# EAGLE board axiom_beta_power_board_v0.27 (EAGLE 7.0.0), part 1 of 3
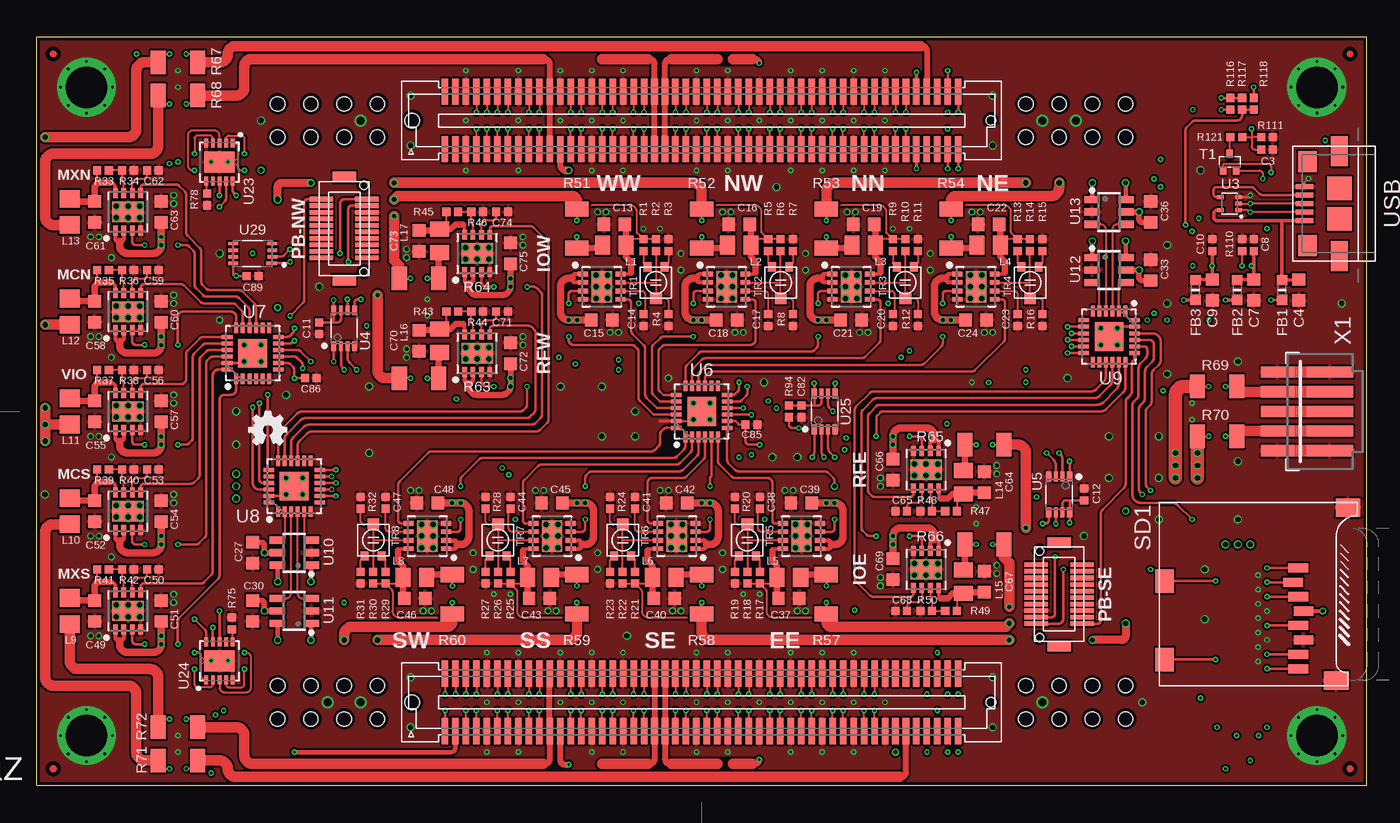
[diagram p10: board, top side]
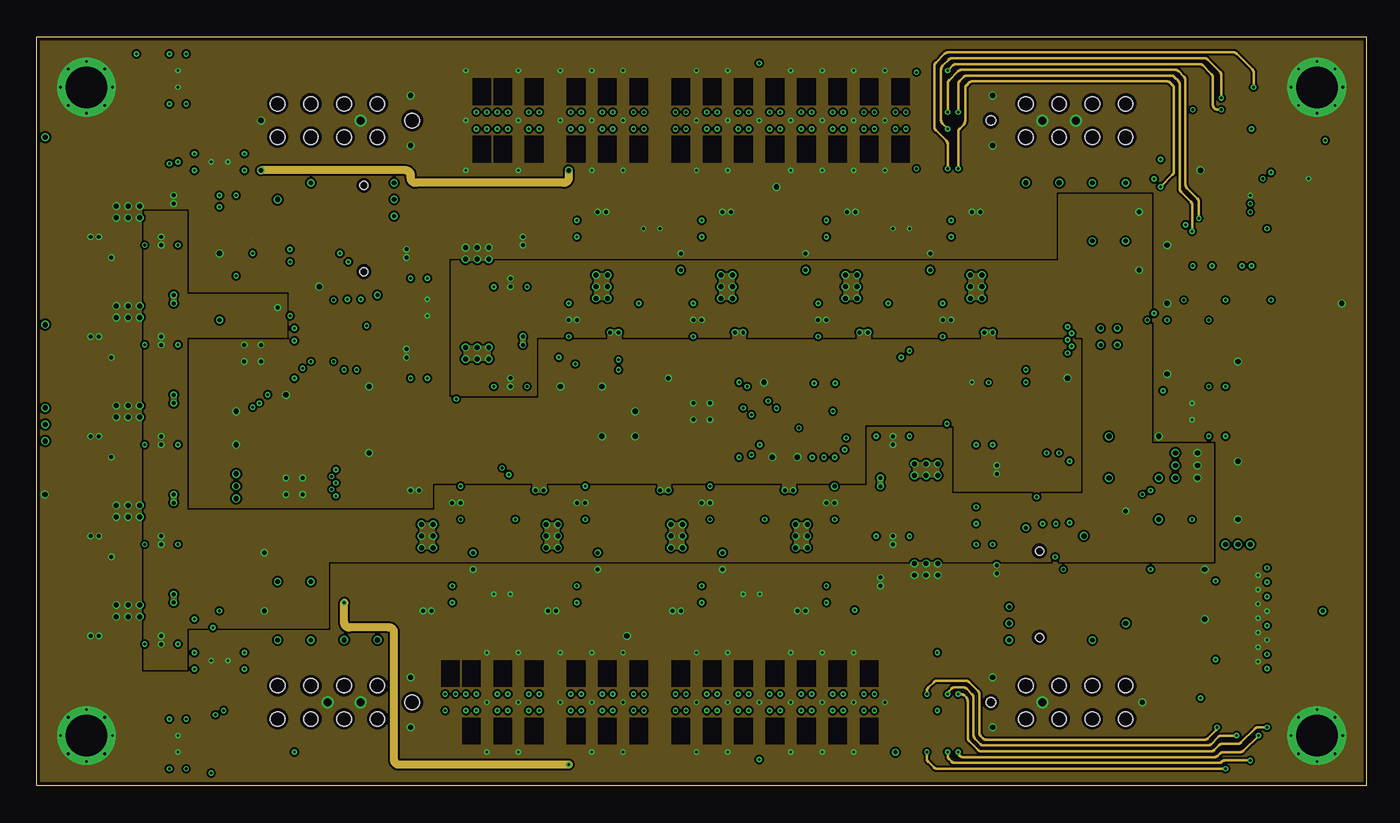
[diagram p11: board, inner layer Route2]
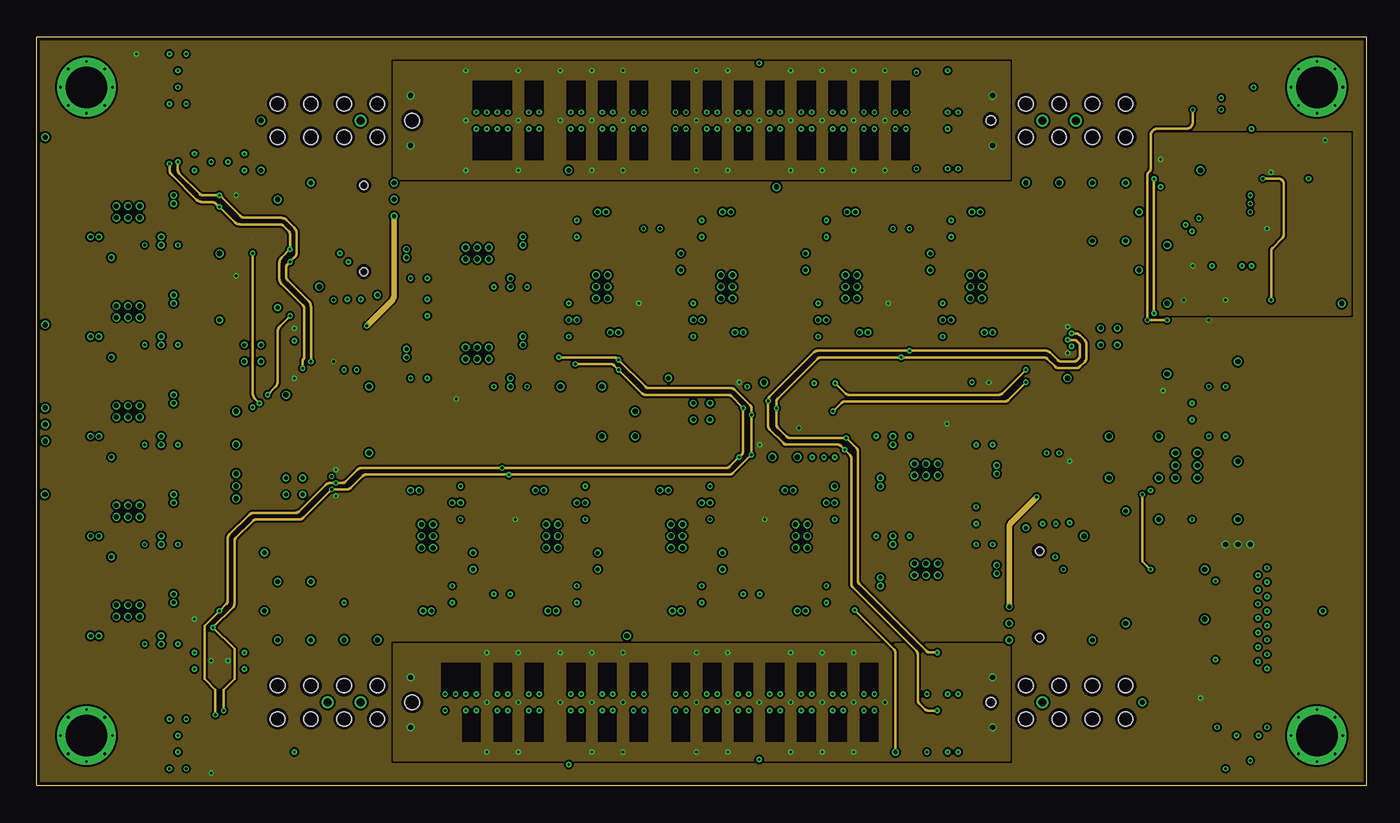
[diagram p12: board, inner layer Route15]
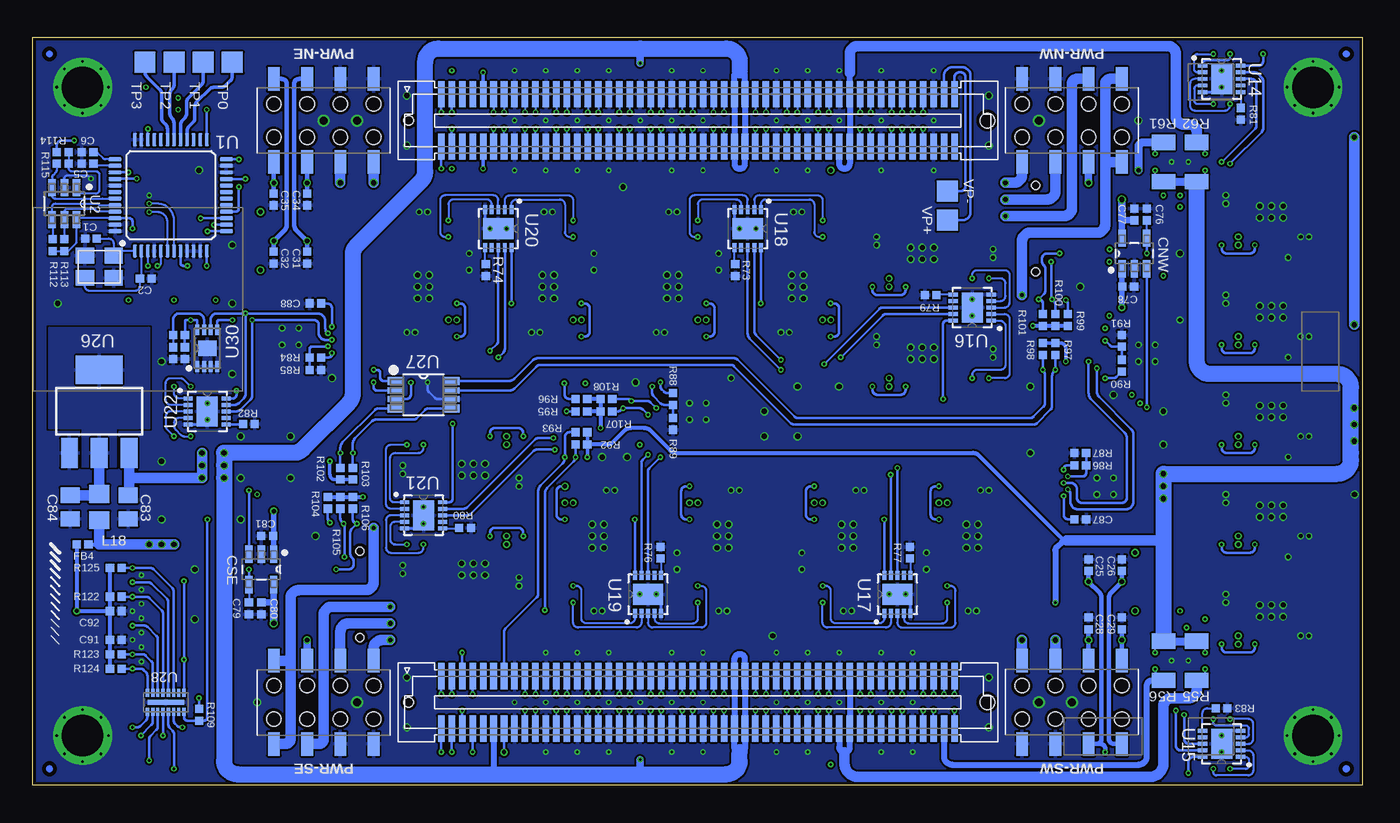
[diagram p13: board, bottom side, seen from below]

Size 101.6 x 57.15 mm. Coordinates in mm from the lower left corner, seen from the top.
Outline: 101.6,57.15 0,57.15 0,0 101.6,0 101.6,57.15
Copper layers (1*2*15*16): Top 0.035559375mm / dielectric 0.17018125mm / Route2 0.01778125mm / dielectric 47mil / Route15 0.01778125mm / dielectric 0.17018125mm / Bottom 0.035559375mm
Design rules "OSHPark-4layer-tuned *": minimum track width 5mil, minimum drill 8mil, track to track 6mil, track to pad 5mil, pad to pad 5mil, via to via 5mil, smd to smd 0mil, copper to edge 10mil, drill to drill 6mil, minimum pad ring 4mil, minimum via ring 4mil, stop-mask expansion 2mil, vias tented up to drill 25mil, thermal gap 6mil
Net classes: 1 LVDS: width 0.152 mm, drill 0.203 mm, clearance 0.152 mm
tKeepout: area 1.3,50.8 to 6.3,55.9; area 1.3,1.3 to 6.3,6.3; area 95.2,1.3 to 100.3,6.3; area 95.2,50.8 to 100.3,55.9
bKeepout: area 95.2,50.8 to 100.3,55.9; area 95.2,1.3 to 100.3,6.3; area 1.3,1.3 to 6.3,6.3; area 1.3,50.8 to 6.3,55.9
tRestrict: area 99.8,55.3 to 100.9,56.4; area 99.8,0.7 to 100.9,1.8; area 0.7,55.3 to 1.8,56.4; area 0.7,0.7 to 1.8,1.8
bRestrict: area 99.8,55.3 to 100.9,56.4; area 99.8,0.7 to 100.9,1.8; area 0.7,55.3 to 1.8,56.4; area 0.7,0.7 to 1.8,1.8

## Footprints (pad centres in the part's own frame; a part is rotated, then mirrored left to right if it is on the bottom)
µZ-SOCKET-NOHOLES-R = smd 0.5 x 2: 1 19.6,24.425; 2 19.6,20.027; 3 18.8,24.425; 4 18.8,20.027; 5 18,24.425; 6 18,20.027; 7 17.2,24.425; 8 17.2,20.027; 9 16.4,24.425; 10 16.4,20.027; 11 15.6,24.425; 12 15.6,20.027; 13 14.8,24.425; 14 14.8,20.027; 15 14,24.425; 16 14,20.027; 17 13.2,24.425; 18 13.2,20.027; 19 12.4,24.425; 20 12.4,20.027; 21 11.6,24.425; 22 11.6,20.027; 23 10.8,24.425; 24 10.8,20.027; 25 10,24.425; 26 10,20.027; 27 9.2,24.425; 28 9.2,20.027; 29 8.4,24.425; 30 8.4,20.027; 31 7.6,24.425; 32 7.6,20.027; 33 6.8,24.425; 34 6.8,20.027; 35 6,24.425; 36 6,20.027; 37 5.2,24.425; 38 5.2,20.027; 39 4.4,24.425; 40 4.4,20.027; 41 3.6,24.425; 42 3.6,20.027; 43 2.8,24.425; 44 2.8,20.027; 45 2,24.425; 46 2,20.027; 47 1.2,24.425; 48 1.2,20.027; 49 0.4,24.425; 50 0.4,20.027; 51 -0.4,24.425; 52 -0.4,20.027; 53 -1.2,24.425; 54 -1.2,20.027; 55 -2,24.425; 56 -2,20.027; 57 -2.8,24.425; 58 -2.8,20.027; 59 -3.6,24.425; 60 -3.6,20.027; 61 -4.4,24.425; 62 -4.4,20.027; 63 -5.2,24.425; 64 -5.2,20.027; 65 -6,24.425; 66 -6,20.027; 67 -6.8,24.425; 68 -6.8,20.027; 69 -7.6,24.425; 70 -7.6,20.027; 71 -8.4,24.425; 72 -8.4,20.027; 73 -9.2,24.425; 74 -9.2,20.027; 75 -10,24.425; 76 -10,20.027; 77 -10.8,24.425; 78 -10.8,20.027; 79 -11.6,24.425; 80 -11.6,20.027; 81 -12.4,24.425; 82 -12.4,20.027; 83 -13.2,24.425; 84 -13.2,20.027; 85 -14,24.425; 86 -14,20.027; 87 -14.8,24.425; 88 -14.8,20.027; 89 -15.6,24.425; 90 -15.6,20.027; 91 -16.4,24.425; 92 -16.4,20.027; 93 -17.2,24.425; 94 -17.2,20.027; 95 -18,24.425; 96 -18,20.027; 97 -18.8,24.425; 98 -18.8,20.027; 99 -19.6,24.425; 100 -19.6,20.027; 101 19.6,-20.025; 102 19.6,-24.425; 103 18.8,-20.027; 104 18.8,-24.425; 105 18,-20.027; 106 18,-24.425; 107 17.2,-20.027; 108 17.2,-24.425; 109 16.4,-20.027; 110 16.4,-24.425; 111 15.6,-20.027; 112 15.6,-24.425; 113 14.8,-20.027; 114 14.8,-24.425; 115 14,-20.027; 116 14,-24.425; 117 13.2,-20.027; 118 13.2,-24.425; 119 12.4,-20.027; 120 12.4,-24.425; 121 11.6,-20.027; 122 11.6,-24.425; 123 10.8,-20.027; 124 10.8,-24.425; 125 10,-20.027; 126 10,-24.425; 127 9.2,-20.027; 128 9.2,-24.425; 129 8.4,-20.027; 130 8.4,-24.425; 131 7.6,-20.027; 132 7.6,-24.425; 133 6.8,-20.027; 134 6.8,-24.425; 135 6,-20.027; 136 6,-24.425; 137 5.2,-20.027; 138 5.2,-24.425; 139 4.4,-20.027; 140 4.4,-24.425; 141 3.6,-20.027; 142 3.6,-24.425; 143 2.8,-20.027; 144 2.8,-24.425; 145 2,-20.027; 146 2,-24.425; 147 1.2,-20.027; 148 1.2,-24.425; 149 0.4,-20.027; 150 0.4,-24.425; 151 -0.4,-20.027; 152 -0.4,-24.425; 153 -1.2,-20.027; 154 -1.2,-24.425; 155 -2,-20.027; 156 -2,-24.425; 157 -2.8,-20.027; 158 -2.8,-24.425; 159 -3.6,-20.027; 160 -3.6,-24.425; 161 -4.4,-20.027; 162 -4.4,-24.425; 163 -5.2,-20.027; 164 -5.2,-24.425; 165 -6,-20.027; 166 -6,-24.425; 167 -6.8,-20.027; 168 -6.8,-24.425; 169 -7.6,-20.027; 170 -7.6,-24.425; 171 -8.4,-20.027; 172 -8.4,-24.425; 173 -9.2,-20.027; 174 -9.2,-24.425; 175 -10,-20.027; 176 -10,-24.425; 177 -10.8,-20.027; 178 -10.8,-24.425; 179 -11.6,-20.027; 180 -11.6,-24.425; 181 -12.4,-20.027; 182 -12.4,-24.425; 183 -13.2,-20.027; 184 -13.2,-24.425; 185 -14,-20.027; 186 -14,-24.425; 187 -14.8,-20.027; 188 -14.8,-24.425; 189 -15.6,-20.027; 190 -15.6,-24.425; 191 -16.4,-20.027; 192 -16.4,-24.425; 193 -17.2,-20.027; 194 -17.2,-24.425; 195 -18,-20.027; 196 -18,-24.425; 197 -18.8,-20.027; 198 -18.8,-24.425; 199 -19.6,-20.027; 200 -19.6,-24.425 | hole 0.725: 22.1,22.225; 22.1,-22.225 | hole 1.125: -22.1,22.225; -22.1,-22.225
0402-B = smd 0.62 x 0.62: 1 -0.45,0; 2 0.45,0
0603-B = smd 0.95 x 1: 1 -0.8,0; 2 0.8,0
0805-B = smd 1.15 x 1.45: 1 -0.9,0; 2 0.9,0
SOT95P280X145-5N = smd 1.321 x 0.559: 1 -1.168,0.94; 2 -1.168,0; 3 -1.168,-0.94; 4 1.168,-0.94; 5 1.168,0.94
DFN65P300X300X100-9N = smd 0.762 x 0.356: 1 -1.422,0.965; 2 -1.422,0.33; 3 -1.422,-0.33; 4 -1.422,-0.965; 5 1.422,-0.965; 6 1.422,-0.33; 7 1.422,0.33; 8 1.422,0.965 | smd 1.549 x 2.413: 9 0,0
_0603MP = smd 0.8 x 0.8: 1 -0.762,0; 2 0.762,0
0805-A = smd 1.35 x 1.55: 1 -1,0; 2 1,0
DF12(XX)-20DP-0.5V = smd 1.8 x 0.35: 1 -1.75,2.25; 2 1.75,2.25; 3 -1.75,1.75; 4 1.75,1.75; 5 -1.75,1.25; 6 1.75,1.25; 7 -1.75,0.75; 8 1.75,0.75; 9 -1.75,0.25; 10 1.75,0.25; 11 -1.75,-0.25; 12 1.75,-0.25; 13 -1.75,-0.75; 14 1.75,-0.75; 15 -1.75,-1.25; 16 1.75,-1.25; 17 -1.75,-1.75; 18 1.75,-1.75; 19 -1.75,-2.25; 20 1.75,-2.25 | smd 1.8 x 0.8: M1 0,3.95; M2 0,-3.95 | hole 0.625: 1.5,-3.3; 1.5,3.3
R2X04 = smd 0.9 x 1.8: 1 -3.81,3.175; 2 -3.81,-3.175; 3 -1.27,3.175; 4 -1.27,-3.175; 5 1.27,3.175; 6 1.27,-3.175; 7 3.81,3.175; 8 3.81,-3.175 | hole 1.1: -3.81,1.27; -1.27,1.27; -1.27,-1.27; -3.81,-1.27; 1.27,1.27; 1.27,-1.27; 3.81,1.27; 3.81,-1.27
ABM8G = smd 1.4 x 1.2: 1 -1.1,-0.85; 2 1.1,-0.85; 3 1.1,0.85; 4 -1.1,0.85
1206-B = smd 1.15 x 1.8: 1 -1.5,0; 2 1.5,0
TF-MICRO-SD_PP2 = smd 0.7 x 1.5: 1 9,-10.64; 2 7.9,-10.24; 3 6.8,-10.64; 4 5.7,-11.04; 5 4.6,-10.64; 6 3.5,-11.04; 7 2.4,-10.64; 8 1.3,-10.64 | smd 1.8 x 1.4: CD1 2,-0.44; CD2 8,-0.44 | smd 1.4 x 1.9: MT1 0.4,-13.54; MT2 13.6,-14.44
SOT416 = smd 0.5 x 0.6: 1 -0.5,-0.65; 2 0.5,-0.65; 3 0,0.65
TP16SQ = smd 1.6 x 1.6: TP 0,0
TRIM-PVZ2A = smd 0.6 x 0.7: 1 -0.65,-1.2; 3 0.65,-1.2 | smd 0.9 x 0.9: 2 0,1.2
LQFP48 = smd 0.3 x 1: 1 -2.75,-4.25; 2 -2.25,-4.25; 3 -1.75,-4.25; 4 -1.25,-4.25; 5 -0.75,-4.25; 6 -0.25,-4.25; 7 0.25,-4.25; 8 0.75,-4.25; 9 1.25,-4.25; 10 1.75,-4.25; 11 2.25,-4.25; 12 2.75,-4.25; 25 2.75,4.25; 26 2.25,4.25; 27 1.75,4.25; 28 1.25,4.25; 29 0.75,4.25; 30 0.25,4.25; 31 -0.25,4.25; 32 -0.75,4.25; 33 -1.25,4.25; 34 -1.75,4.25; 35 -2.25,4.25; 36 -2.75,4.25 | smd 1 x 0.3: 13 4.25,-2.75; 14 4.25,-2.25; 15 4.25,-1.75; 16 4.25,-1.25; 17 4.25,-0.75; 18 4.25,-0.25; 19 4.25,0.25; 20 4.25,0.75; 21 4.25,1.25; 22 4.25,1.75; 23 4.25,2.25; 24 4.25,2.75; 37 -4.25,2.75; 38 -4.25,2.25; 39 -4.25,1.75; 40 -4.25,1.25; 41 -4.25,0.75; 42 -4.25,0.25; 43 -4.25,-0.25; 44 -4.25,-0.75; 45 -4.25,-1.25; 46 -4.25,-1.75; 47 -4.25,-2.25; 48 -4.25,-2.75
SOT95P280X145-6N = smd 1.27 x 0.559: 1 -1.219,0.94; 2 -1.219,0; 3 -1.219,-0.94; 4 1.219,-0.94; 5 1.219,0; 6 1.219,0.94
R-PDSO-N5 = smd 0.3 x 0.5: 1 -0.5,-0.675; 2 0,-0.675; 3 0.5,-0.675; 4 0.5,0.675; 5 -0.5,0.675
VSSOP-8 = smd 0.75 x 0.4: 1 -1.375,0.8; 4 -1.375,-0.8; 5 1.375,-0.8; 8 1.375,0.8 | smd 0.75 x 0.3: 2 -1.375,0.25; 3 -1.375,-0.25; 6 1.375,-0.25; 7 1.375,0.25
QFN50P400X400X80-25N = smd 0.813 x 0.305: 1 -1.95,1.25; 2 -1.95,0.75; 3 -1.95,0.25; 4 -1.95,-0.25; 5 -1.95,-0.75; 6 -1.95,-1.25; 13 1.95,-1.25; 14 1.95,-0.75; 15 1.95,-0.25; 16 1.95,0.25; 17 1.95,0.75; 18 1.95,1.25 | smd 0.305 x 0.813: 7 -1.25,-1.95; 8 -0.75,-1.95; 9 -0.25,-1.95; 10 0.25,-1.95; 11 0.75,-1.95; 12 1.25,-1.95; 19 1.25,1.95; 20 0.75,1.95; 21 0.25,1.95; 22 -0.25,1.95; 23 -0.75,1.95; 24 -1.25,1.95 | smd 2.2 x 2.2: 25 0,0
SOT23-6 = smd 0.55 x 1.2: 1 -0.95,-1.3; 2 0,-1.3; 3 0.95,-1.3; 4 0.95,1.3; 5 0,1.3; 6 -0.95,1.3
DFN3X3_10LEAD = smd 0.7 x 0.3: 1 -1.45,1; 2 -1.45,0.5; 3 -1.45,0; 4 -1.45,-0.5; 5 -1.45,-1; 6 1.45,-1; 7 1.45,-0.5; 8 1.45,0; 9 1.45,0.5; 10 1.45,1 | smd 1.6 x 2.3: EPAD 0,0
SOT-223 = smd 1.27 x 2.286: 1 -2.286,-3.175; 2 0,-3.175; 3 2.286,-3.175 | smd 3.556 x 2.159: TER 0,3.175
SOP65P490X300-8N = smd 1.15 x 0.6: 1 -2.175,1.05; 4 -2.175,-1.05; 5 2.175,-1.05; 8 2.175,1.05 | smd 1.15 x 0.45: 2 -2.175,0.325; 3 -2.175,-0.325; 6 2.175,-0.325; 7 2.175,0.325
SON40P135X330X55-17N = smd 0.61 x 0.254: 1 -0.737,1.397; 2 -0.737,0.991; 3 -0.737,0.61; 4 -0.737,0.203; 5 -0.737,-0.203; 6 -0.737,-0.61; 7 -0.737,-0.991; 8 -0.737,-1.397; 9 0.737,-1.397; 10 0.737,-0.991; 11 0.737,-0.61; 12 0.737,-0.203; 13 0.737,0.203; 14 0.737,0.61; 15 0.737,0.991; 16 0.737,1.397 | smd 0.406 x 2.794: 17 0,0
SOT996-2/3 = smd 0.25 x 0.85: 1 -0.75,-1.45 | smd 0.25 x 0.75: 2 -0.25,-1.5; 3 0.25,-1.5; 4 0.75,-1.5; 5 0.75,1.5; 6 0.25,1.5; 7 -0.25,1.5; 8 -0.75,1.5
DFN200X300X100-9N = smd 0.813 x 0.305: 1 -1.397,0.762; 2 -1.397,0.254; 3 -1.397,-0.254; 4 -1.397,-0.762; 5 1.397,-0.762; 6 1.397,-0.254; 7 1.397,0.254; 8 1.397,0.762 | smd 1.194 x 1.397: EP 0,0
MICRO-AB-H-SMT = smd 0.4 x 1.35: 1 -1.3,4.125; 2 -0.65,4.125; 3 0,4.125; 4 0.65,4.125; 5 1.3,4.125 | smd 2.3 x 1.3: Z1 -4,1.45; Z4 4,1.45 | smd 1.8 x 1.9: Z2 -1.15,1.45; Z3 1.15,1.45 | smd 1.6 x 1.4: Z5 -3.2,3.9; Z6 3.2,3.9
PICO-SPOX-5 = smd 0.85 x 2.55: 1 -3,-6.5; 2 -1.5,-6.5; 3 0,-6.5; 4 1.5,-6.5; 5 3,-6.5 | smd 0.85 x 3.55: 1A -3,-2.5; 2A -1.5,-2.5; 3A 0,-2.5; 4A 1.5,-2.5; 5A 3,-2.5
µZ-CONONLY = smd 0.5 x 2: 1 19.6,-24.226; 2 19.6,-20.226; 3 18.8,-24.226; 4 18.8,-20.226; 5 18,-24.226; 6 18,-20.226; 7 17.2,-24.226; 8 17.2,-20.226; 9 16.4,-24.226; 10 16.4,-20.226; 11 15.6,-24.226; 12 15.6,-20.226; 13 14.8,-24.226; 14 14.8,-20.226; 15 14,-24.226; 16 14,-20.226; 17 13.2,-24.226; 18 13.2,-20.226; 19 12.4,-24.226; 20 12.4,-20.226; 21 11.6,-24.226; 22 11.6,-20.226; 23 10.8,-24.226; 24 10.8,-20.226; 25 10,-24.226; 26 10,-20.226; 27 9.2,-24.226; 28 9.2,-20.226; 29 8.4,-24.226; 30 8.4,-20.226; 31 7.6,-24.226; 32 7.6,-20.226; 33 6.8,-24.226; 34 6.8,-20.226; 35 6,-24.226; 36 6,-20.226; 37 5.2,-24.226; 38 5.2,-20.226; 39 4.4,-24.226; 40 4.4,-20.226; 41 3.6,-24.226; 42 3.6,-20.226; 43 2.8,-24.226; 44 2.8,-20.226; 45 2,-24.226; 46 2,-20.226; 47 1.2,-24.226; 48 1.2,-20.226; 49 0.4,-24.226; 50 0.4,-20.226; 51 -0.4,-24.226; 52 -0.4,-20.226; 53 -1.2,-24.226; 54 -1.2,-20.226; 55 -2,-24.226; 56 -2,-20.226; 57 -2.8,-24.226; 58 -2.8,-20.226; 59 -3.6,-24.226; 60 -3.6,-20.226; 61 -4.4,-24.226; 62 -4.4,-20.226; 63 -5.2,-24.226; 64 -5.2,-20.226; 65 -6,-24.226; 66 -6,-20.226; 67 -6.8,-24.226; 68 -6.8,-20.226; 69 -7.6,-24.226; 70 -7.6,-20.226; 71 -8.4,-24.226; 72 -8.4,-20.226; 73 -9.2,-24.226; 74 -9.2,-20.226; 75 -10,-24.226; 76 -10,-20.226; 77 -10.8,-24.226; 78 -10.8,-20.226; 79 -11.6,-24.226; 80 -11.6,-20.226; 81 -12.4,-24.226; 82 -12.4,-20.226; 83 -13.2,-24.226; 84 -13.2,-20.226; 85 -14,-24.226; 86 -14,-20.226; 87 -14.8,-24.226; 88 -14.8,-20.226; 89 -15.6,-24.226; 90 -15.6,-20.226; 91 -16.4,-24.226; 92 -16.4,-20.226; 93 -17.2,-24.226; 94 -17.2,-20.226; 95 -18,-24.226; 96 -18,-20.226; 97 -18.8,-24.226; 98 -18.8,-20.226; 99 -19.6,-24.226; 100 -19.6,-20.226; 101 19.6,20.226; 102 19.6,24.226; 103 18.8,20.226; 104 18.8,24.226; 105 18,20.226; 106 18,24.226; 107 17.2,20.226; 108 17.2,24.226; 109 16.4,20.226; 110 16.4,24.226; 111 15.6,20.226; 112 15.6,24.226; 113 14.8,20.226; 114 14.8,24.226; 115 14,20.226; 116 14,24.226; 117 13.2,20.226; 118 13.2,24.226; 119 12.4,20.226; 120 12.4,24.226; 121 11.6,20.226; 122 11.6,24.226; 123 10.8,20.226; 124 10.8,24.226; 125 10,20.226; 126 10,24.226; 127 9.2,20.226; 128 9.2,24.226; 129 8.4,20.226; 130 8.4,24.226; 131 7.6,20.226; 132 7.6,24.226; 133 6.8,20.226; 134 6.8,24.226; 135 6,20.226; 136 6,24.226; 137 5.2,20.226; 138 5.2,24.226; 139 4.4,20.226; 140 4.4,24.226; 141 3.6,20.226; 142 3.6,24.226; 143 2.8,20.226; 144 2.8,24.226; 145 2,20.226; 146 2,24.226; 147 1.2,20.226; 148 1.2,24.226; 149 0.4,20.226; 150 0.4,24.226; 151 -0.4,20.226; 152 -0.4,24.226; 153 -1.2,20.226; 154 -1.2,24.226; 155 -2,20.226; 156 -2,24.226; 157 -2.8,20.226; 158 -2.8,24.226; 159 -3.6,20.226; 160 -3.6,24.226; 161 -4.4,20.226; 162 -4.4,24.226; 163 -5.2,20.226; 164 -5.2,24.226; 165 -6,20.226; 166 -6,24.226; 167 -6.8,20.226; 168 -6.8,24.226; 169 -7.6,20.226; 170 -7.6,24.226; 171 -8.4,20.226; 172 -8.4,24.226; 173 -9.2,20.226; 174 -9.2,24.226; 175 -10,20.226; 176 -10,24.226; 177 -10.8,20.226; 178 -10.8,24.226; 179 -11.6,20.226; 180 -11.6,24.226; 181 -12.4,20.226; 182 -12.4,24.226; 183 -13.2,20.226; 184 -13.2,24.226; 185 -14,20.226; 186 -14,24.226; 187 -14.8,20.226; 188 -14.8,24.226; 189 -15.6,20.226; 190 -15.6,24.226; 191 -16.4,20.226; 192 -16.4,24.226; 193 -17.2,20.226; 194 -17.2,24.226; 195 -18,20.226; 196 -18,24.226; 197 -18.8,20.226; 198 -18.8,24.226; 199 -19.6,20.226; 200 -19.6,24.226 | hole 1.125: -22.1,-22.225; -22.1,22.225 | hole 0.725: 22.1,-22.225; 22.1,22.225

## Placement (x,y rotation side)
BETA  µZ-FCI-SOCKET-NOHOLES-R  [µZ-SOCKET-NOHOLES-R]  50.8,28.57 0 top
C1  15p  [0402-B]  97.16,41.78 180 bottom
C2  15p  [0402-B]  92.96,38.73 0 bottom
C3  10n  [0402-B]  93.98,48.58 0 top
C4  100n  [0603-B]  96.39,37.85 270 top
C5  100n  [0402-B]  97.41,47.5 180 bottom
C6  100n  [0402-B]  97.41,48.39 180 bottom
C7  4u7  [0603-B]  92.96,37.85 270 top
C8  100n  [0402-B]  92.96,41.27 90 top
C9  4u7  [0603-B]  89.79,37.85 270 top
C10  100n  [0402-B]  89.79,41.27 90 top
C11  10n  [0402-B]  21.59,34.92 270 top
C12  10n  [0402-B]  80.01,22.23 90 top
C13  4u7  [0603-B]  44.13,42.86 180 top
C14  DNP  [0402-B]  46.35,35.56 270 top  (not fitted)
C15  10u  [0603-B]  43.18,35.56 0 top
C16  4u7  [0603-B]  53.66,42.86 180 top
C17  DNP  [0402-B]  55.88,35.56 270 top  (not fitted)
C18  10u  [0603-B]  52.7,35.56 0 top
C19  4u7  [0603-B]  63.18,42.86 180 top
C20  DNP  [0402-B]  65.41,35.56 270 top  (not fitted)
C21  10u  [0603-B]  62.23,35.56 0 top
C22  4u7  [0603-B]  72.71,42.86 180 top
C23  DNP  [0402-B]  74.93,35.56 270 top  (not fitted)
C24  10u  [0603-B]  71.75,35.56 0 top
C25  1u  [0402-B]  20.95,16.83 90 bottom
C26  1u  [0402-B]  18.41,16.83 90 bottom
C27  4u7  [0603-B]  16.51,17.78 270 top
C28  1u  [0402-B]  20.95,12.38 90 bottom
C29  1u  [0402-B]  18.41,12.38 90 bottom
C30  4u7  [0603-B]  16.51,13.33 270 top
C31  1u  [0402-B]  80.64,40.32 270 bottom
C32  1u  [0402-B]  83.19,40.32 270 bottom
C33  4u7  [0603-B]  85.09,39.37 90 top
C34  1u  [0402-B]  80.64,44.77 270 bottom
C35  1u  [0402-B]  83.19,44.77 270 bottom
C36  4u7  [0603-B]  85.09,43.81 90 top
C37  4u7  [0603-B]  57.47,14.29 0 top
C38  DNP  [0402-B]  55.24,21.59 90 top  (not fitted)
C39  10u  [0603-B]  58.42,21.59 180 top
C40  4u7  [0603-B]  47.94,14.29 0 top
C41  DNP  [0402-B]  45.72,21.59 90 top  (not fitted)
C42  10u  [0603-B]  48.89,21.59 180 top
C43  4u7  [0603-B]  38.42,14.29 0 top
C44  DNP  [0402-B]  36.19,21.59 90 top  (not fitted)
C45  10u  [0603-B]  39.37,21.59 180 top
C46  4u7  [0603-B]  28.89,14.29 0 top
C47  DNP  [0402-B]  26.67,21.59 90 top  (not fitted)
C48  10u  [0603-B]  29.84,21.59 180 top
C49  4u7  [0603-B]  4.45,13.33 270 top
C50  DNP  [0402-B]  8.89,16.51 0 top  (not fitted)
C51  10u  [0603-B]  9.52,13.33 90 top
C52  4u7  [0603-B]  4.45,20.95 270 top
C53  DNP  [0402-B]  8.89,24.13 0 top  (not fitted)
C54  10u  [0603-B]  9.52,20.95 90 top
C55  4u7  [0603-B]  4.45,28.57 270 top
C56  DNP  [0402-B]  8.89,31.75 0 top  (not fitted)
C57  10u  [0603-B]  9.52,28.57 90 top
C58  4u7  [0603-B]  4.45,36.2 270 top
C59  DNP  [0402-B]  8.89,39.37 0 top  (not fitted)
C60  10u  [0603-B]  9.52,36.2 90 top
C61  4u7  [0603-B]  4.45,43.81 270 top
C62  DNP  [0402-B]  8.89,46.99 0 top  (not fitted)
C63  10u  [0603-B]  9.52,43.81 90 top
C64  4u7  [0603-B]  72.39,23.18 90 top
C65  DNP  [0402-B]  66.04,20.95 180 top  (not fitted)
C66  10u  [0603-B]  65.41,24.13 270 top
C67  4u7  [0603-B]  72.39,15.56 90 top
C68  DNP  [0402-B]  66.04,13.33 180 top  (not fitted)
C69  10u  [0603-B]  65.41,16.51 270 top
C70  4u7  [0603-B]  29.21,33.97 270 top
C71  DNP  [0402-B]  35.56,36.2 0 top  (not fitted)
C72  10u  [0603-B]  36.19,33.02 90 top
C73  4u7  [0603-B]  29.21,41.59 270 top
C74  DNP  [0402-B]  35.56,43.81 0 top  (not fitted)
C75  10u  [0603-B]  36.19,40.64 90 top
C76  10n  [0402-B]  16.51,43.62 90 bottom
C77  1u  [0402-B]  17.46,43.62 90 bottom
C78  1u  [0402-B]  17.93,38.1 0 bottom
C79  10n  [0402-B]  85.09,13.53 270 bottom
C80  1u  [0402-B]  84.14,13.53 270 bottom
C81  1u  [0402-B]  83.69,19.05 180 bottom
C82  10n  [0402-B]  58.42,28.57 270 top
C83  22u  [0805-B]  94.3,21.27 270 bottom
C84  22u  [0805-B]  98.74,21.27 270 bottom
C85  100n  [0402-B]  54.61,27.56 0 top
C86  100n  [0402-B]  20.95,31.11 0 top
C87  100n  [0402-B]  21.59,20.32 0 bottom
C88  100n  [0402-B]  80.01,36.83 180 bottom
C89  100n  [0402-B]  16.51,38.93 0 top
C90  100n  [0402-B]  89.98,33.02 270 bottom
C91  1u  [0402-B]  95.25,11.12 0 bottom
C92  100n  [0402-B]  95.25,13.32 0 bottom
CNW  SPX3819M5-L  [SOT95P280X145-5N]  17.46,40.64 90 bottom
CSE  SPX3819M5-L  [SOT95P280X145-5N]  84.14,16.51 270 bottom
EE  MCP1727-ADJE/MF  [DFN65P300X300X100-9N]  58.42,19.05 180 top
FB1  600R  [_0603MP]  95.12,37.85 270 top
FB2  600R  [_0603MP]  91.69,37.85 90 top
FB3  600R  [_0603MP]  88.52,37.85 90 top
FB4  [0402-B]  97.79,18.41 180 bottom
IOE  MCP1727-ADJE/MF  [DFN65P300X300X100-9N]  67.94,16.51 270 top
IOW  MCP1727-ADJE/MF  [DFN65P300X300X100-9N]  33.66,40.64 90 top
L1  [0805-B]  44.13,41.27 180 top
L2  [0805-B]  53.66,41.27 180 top
L3  [0805-B]  63.18,41.27 180 top
L4  [0805-B]  72.71,41.27 180 top
L5  [0805-B]  57.47,15.88 0 top
L6  [0805-B]  47.94,15.88 0 top
L7  [0805-B]  38.42,15.88 0 top
L8  [0805-B]  28.89,15.88 0 top
L9  [0805-A]  2.54,13.33 270 top
L10  [0805-A]  2.54,20.95 270 top
L11  [0805-A]  2.54,28.57 270 top
L12  [0805-A]  2.54,36.2 270 top
L13  [0805-A]  2.54,43.81 270 top
L14  [0805-B]  70.8,23.18 90 top
L15  [0805-B]  70.8,15.56 90 top
L16  [0805-B]  30.8,33.97 270 top
L17  [0805-B]  30.8,41.59 270 top
L18  [0805-A]  96.52,21.27 270 bottom
LOGO1  OSHW_LOGO_FILLX0100-NT  [OSHW_FILLX100_NOTEXT]  16.26,26.04 0 top
MCN  MCP1727-ADJE/MF  [DFN65P300X300X100-9N]  6.98,36.2 90 top
MCS  MCP1727-ADJE/MF  [DFN65P300X300X100-9N]  6.98,20.95 90 top
MXN  MCP1727-ADJE/MF  [DFN65P300X300X100-9N]  6.98,43.81 90 top
MXS  MCP1727-ADJE/MF  [DFN65P300X300X100-9N]  6.98,13.33 90 top
NE  MCP1727-ADJE/MF  [DFN65P300X300X100-9N]  71.75,38.1 0 top
NN  MCP1727-ADJE/MF  [DFN65P300X300X100-9N]  62.23,38.1 0 top
NW  MCP1727-ADJE/MF  [DFN65P300X300X100-9N]  52.7,38.1 0 top
PB-NW  DF12(XX)-20DP-0.5V  [DF12(XX)-20DP-0.5V]  23.49,42.55 0 top
PB-SE  DF12(XX)-20DP-0.5V  [DF12(XX)-20DP-0.5V]  78.1,14.6 180 top
PWR-NE  PINRC-2X04  [R2X04]  79.38,50.8 180 bottom  (not fitted)
PWR-NW  PINRC-2X04  [R2X04]  22.22,50.8 0 bottom  (not fitted)
PWR-SE  PINRC-2X04  [R2X04]  79.38,6.35 180 bottom  (not fitted)
PWR-SW  PINRC-2X04  [R2X04]  22.22,6.35 0 bottom  (not fitted)
Q1  SMD-4P-2G-3.2X2.5  [ABM8G]  96.52,39.62 180 bottom
R1  RB  [0402-B]  46.35,41.27 90 top
R2  DNP  [0402-B]  47.31,41.27 270 top  (not fitted)
R3  DNP  [0402-B]  48.26,41.27 90 top  (not fitted)
R4  RA  [0402-B]  48.26,35.56 270 top
R5  RB  [0402-B]  55.88,41.27 90 top
R6  DNP  [0402-B]  56.83,41.27 270 top  (not fitted)
R7  DNP  [0402-B]  57.78,41.27 90 top  (not fitted)
R8  RA  [0402-B]  57.78,35.56 270 top
R9  RB  [0402-B]  65.41,41.27 90 top
R10  DNP  [0402-B]  66.36,41.27 270 top  (not fitted)
R11  DNP  [0402-B]  67.31,41.27 90 top  (not fitted)
R12  RA  [0402-B]  67.31,35.56 270 top
R13  RB  [0402-B]  74.93,41.27 90 top
R14  DNP  [0402-B]  75.88,41.27 270 top  (not fitted)
R15  DNP  [0402-B]  76.83,41.27 90 top  (not fitted)
R16  RA  [0402-B]  76.83,35.56 270 top
R17  RB  [0402-B]  55.24,15.88 270 top
R18  DNP  [0402-B]  54.29,15.88 90 top  (not fitted)
R19  DNP  [0402-B]  53.34,15.88 270 top  (not fitted)
R20  RA  [0402-B]  53.34,21.59 90 top
R21  RB  [0402-B]  45.72,15.88 270 top
R22  DNP  [0402-B]  44.77,15.88 90 top  (not fitted)
R23  DNP  [0402-B]  43.81,15.88 270 top  (not fitted)
R24  RA  [0402-B]  43.81,21.59 90 top
R25  RB  [0402-B]  36.19,15.88 270 top
R26  DNP  [0402-B]  35.24,15.88 90 top  (not fitted)
R27  DNP  [0402-B]  34.29,15.88 270 top  (not fitted)
R28  RA  [0402-B]  34.29,21.59 90 top
R29  RB  [0402-B]  26.67,15.88 270 top
R30  DNP  [0402-B]  25.72,15.88 90 top  (not fitted)
R31  DNP  [0402-B]  24.76,15.88 270 top  (not fitted)
R32  RA  [0402-B]  24.76,21.59 90 top
R33  RD  [0402-B]  5.08,46.99 0 top
R34  RC  [0402-B]  6.98,46.99 0 top
R35  RD  [0402-B]  5.08,39.37 0 top
R36  RC  [0402-B]  6.98,39.37 0 top
R37  102k  [0402-B]  5.08,31.75 0 top
R38  20k  [0402-B]  6.98,31.75 0 top
R39  RD  [0402-B]  5.08,24.13 0 top
R40  RC  [0402-B]  6.98,24.13 0 top
R41  RD  [0402-B]  5.08,16.51 0 top
R42  RC  [0402-B]  6.98,16.51 0 top
R43  RD  [0402-B]  31.75,36.2 0 top
R44  RC  [0402-B]  33.66,36.2 0 top
R45  RD  [0402-B]  31.75,43.81 0 top
R46  RC  [0402-B]  33.66,43.81 0 top
R47  RD  [0402-B]  69.85,20.95 180 top
R48  RC  [0402-B]  67.94,20.95 180 top
R49  RD  [0402-B]  69.85,13.33 180 top
R50  RC  [0402-B]  67.94,13.33 180 top
R51  [1206-B]  41.27,42.55 90 top
R52  [1206-B]  50.8,42.55 90 top
R53  [1206-B]  60.32,42.55 90 top
R54  [1206-B]  69.85,42.55 90 top
R55  [1206-B]  12.7,9.52 270 bottom
R56  [1206-B]  15.24,9.52 270 bottom
R57  [1206-B]  60.32,14.6 270 top
R58  [1206-B]  50.8,14.6 270 top
R59  [1206-B]  41.27,14.6 270 top
R60  [1206-B]  31.75,14.6 270 top
R61  [1206-B]  15.24,47.62 90 bottom
R62  [1206-B]  12.7,47.62 90 bottom
R63  [1206-B]  29.21,31.11 180 top
R64  [1206-B]  29.21,38.73 180 top
R65  [1206-B]  72.39,26.04 0 top
R66  [1206-B]  72.39,18.41 0 top
R67  [1206-B]  10.79,55.25 0 top
R68  [1206-B]  10.79,52.7 0 top
R69  [1206-B]  90.17,30.48 180 top
R70  [1206-B]  90.17,26.67 180 top
R71  [1206-B]  10.79,1.9 0 top
R72  [1206-B]  10.79,4.45 0 top
R73  750R  [0402-B]  47.94,39.37 270 bottom
R74  1k27  [0402-B]  66.99,39.37 270 bottom
R75  430R  [0402-B]  14.92,12.38 90 top
R76  0R  [0402-B]  53.66,17.78 90 bottom
R77  100R  [0402-B]  34.61,17.78 90 bottom
R78  560R  [0402-B]  13.02,44.77 270 top
R79  5k6  [0402-B]  33.02,37.47 180 bottom
R80  9k1  [0402-B]  68.58,19.68 0 bottom
R81  2k0  [0402-B]  9.33,51.31 270 bottom
R82  1k6  [0402-B]  85.09,27.62 0 bottom
R83  2k7  [0402-B]  10.79,5.91 0 bottom
R84  22k  [0402-B]  80.01,32.7 180 bottom
R85  10k  [0402-B]  80.01,31.75 0 bottom
R86  13k  [0402-B]  21.59,24.45 0 bottom
R87  10k  [0402-B]  21.59,25.4 180 bottom
R88  13k  [0402-B]  52.7,29.53 270 bottom
R89  3k  [0402-B]  52.7,27.62 270 bottom
R90  15k  [0402-B]  18.41,32.07 90 bottom
R91  1k  [0402-B]  18.41,33.97 90 bottom
R92  4k7  [0402-B]  59.69,26.04 180 bottom
R93  4k7  [0402-B]  59.69,26.99 180 bottom
R94  200k  [0402-B]  57.47,28.57 90 top
R95  4k7  [0402-B]  59.69,28.57 180 bottom
R96  4k7  [0402-B]  59.69,29.53 180 bottom
R97  4k7  [0402-B]  23.49,33.34 270 bottom
R98  4k7  [0402-B]  24.45,33.34 270 bottom
R99  200k  [0402-B]  22.54,35.56 90 bottom
R100  4k7  [0402-B]  23.49,35.56 90 bottom
R101  4k7  [0402-B]  24.45,35.56 90 bottom
R102  4k7  [0402-B]  78.1,23.81 90 bottom
R103  4k7  [0402-B]  77.15,23.81 90 bottom
R104  200k  [0402-B]  79.06,21.59 270 bottom
R105  4k7  [0402-B]  78.1,21.59 270 bottom
R106  4k7  [0402-B]  77.15,21.59 270 bottom
R107  4k7  [0402-B]  57.78,28.57 0 bottom
R108  4k7  [0402-B]  57.78,29.53 0 bottom
R109  10k  [0402-B]  88.9,5.4 270 bottom
R110  12k  [0402-B]  92.07,41.27 270 top
R111  6k8  [0402-B]  93.98,49.53 180 top
R112  10k  [0402-B]  100.08,41.27 270 bottom
R113  10k  [0402-B]  99.19,41.27 270 bottom
R114  10k  [0402-B]  99.31,48.39 180 bottom
R115  2k  [0402-B]  99.31,47.5 180 bottom
R116  0R  [0402-B]  91.19,52.07 90 top
R117  0R  [0402-B]  92.07,52.07 90 top
R118  0R  [0402-B]  92.96,52.07 90 top
R119  10k  [0402-B]  90.42,34.42 180 bottom
R120  0R  [0402-B]  90.87,33.02 270 bottom
R121  3k9  [0402-B]  91.63,49.53 180 top
R122  50k  [0402-B]  95.25,14.42 0 bottom
R123  50k  [0402-B]  95.25,10.02 0 bottom
R124  50k  [0402-B]  95.25,8.92 0 bottom
R125  50k  [0402-B]  95.25,16.62 0 bottom
RFE  MCP1727-ADJE/MF  [DFN65P300X300X100-9N]  67.94,24.13 270 top
RFW  MCP1727-ADJE/MF  [DFN65P300X300X100-9N]  33.66,33.02 90 top
SD1  MICRO-SD-2CD  [TF-MICRO-SD_PP2]  85.72,7.62 90 top
SE  MCP1727-ADJE/MF  [DFN65P300X300X100-9N]  48.89,19.05 180 top
SS  MCP1727-ADJE/MF  [DFN65P300X300X100-9N]  39.37,19.05 180 top
SW  MCP1727-ADJE/MF  [DFN65P300X300X100-9N]  29.84,19.05 180 top
T1  NX3008PBKT  [SOT416]  91.12,47.62 0 top
TP0  TPTP16SQ  [TP16SQ]  86.36,55.25 0 bottom
TP1  TPTP16SQ  [TP16SQ]  88.58,55.25 180 bottom
TP2  TPTP16SQ  [TP16SQ]  90.81,55.25 0 bottom
TP3  TPTP16SQ  [TP16SQ]  93.03,55.25 0 bottom
TR1  PVZ2A  [TRIM-PVZ2A]  47.31,38.42 180 top
TR2  PVZ2A  [TRIM-PVZ2A]  56.83,38.42 180 top
TR3  PVZ2A  [TRIM-PVZ2A]  66.36,38.42 180 top
TR4  PVZ2A  [TRIM-PVZ2A]  75.88,38.42 180 top
TR5  PVZ2A  [TRIM-PVZ2A]  54.29,18.73 0 top
TR6  PVZ2A  [TRIM-PVZ2A]  44.77,18.73 0 top
TR7  PVZ2A  [TRIM-PVZ2A]  35.24,18.73 0 top
TR8  PVZ2A  [TRIM-PVZ2A]  25.72,18.73 0 top
U1  FT232HL  [LQFP48]  91.06,45.09 0 bottom
U2  93LC46BT-I/OT  [SOT95P280X145-6N]  99.19,44.45 270 bottom
U3  TPD3E001DRL  [R-PDSO-N5]  91.12,44.45 90 top
U4  GTL2002DC  [VSSOP-8]  23.49,34.92 90 top
U5  GTL2002DC  [VSSOP-8]  78.1,22.23 270 top
U6  MCP23018-E/MJ  [QFN50P400X400X80-25N]  50.8,28.57 90 top
U7  MCP23018-E/MJ  [QFN50P400X400X80-25N]  16.51,33.02 90 top
U8  MCP23018-E/MJ  [QFN50P400X400X80-25N]  19.68,22.86 90 top
U9  MCP23018-E/MJ  [QFN50P400X400X80-25N]  81.91,34.29 270 top
U10  AP7312-3333W6-7  [SOT23-6]  19.68,17.78 90 top
U11  AP7312-3333W6-7  [SOT23-6]  19.68,13.33 90 top
U12  AP7312-3333W6-7  [SOT23-6]  81.91,39.37 270 top
U13  AP7312-3333W6-7  [SOT23-6]  81.91,43.81 270 top
U14  PAC1720  [DFN3X3_10LEAD]  10.79,53.97 0 bottom
U15  PAC1720  [DFN3X3_10LEAD]  10.79,3.18 180 bottom
U16  PAC1720  [DFN3X3_10LEAD]  29.84,36.51 180 bottom
U17  PAC1720  [DFN3X3_10LEAD]  35.56,14.6 90 bottom
U18  PAC1720  [DFN3X3_10LEAD]  46.99,42.55 270 bottom
U19  PAC1720  [DFN3X3_10LEAD]  54.61,14.6 90 bottom
U20  PAC1720  [DFN3X3_10LEAD]  66.04,42.55 270 bottom
U21  PAC1720  [DFN3X3_10LEAD]  71.75,20.64 0 bottom
U22  PAC1720  [DFN3X3_10LEAD]  88.27,28.57 0 bottom
U23  PAC1720  [DFN3X3_10LEAD]  13.97,47.62 270 top
U24  PAC1720  [DFN3X3_10LEAD]  13.97,9.52 90 top
U25  GTL2002DC  [VSSOP-8]  60.2,28.57 90 top
U26  LD1117S33TR  [SOT-223]  96.52,28.57 0 bottom
U27  PCA9540BDP  [SOP65P490X300-8N]  71.75,29.84 0 bottom
U28  IP4251CZ16-8-TTL  [SON40P135X330X55-17N]  91.44,6.35 270 bottom
U29  LM75BGD  [SOT996-2/3]  16.51,40.64 90 top
U30  BR24G04NUX  [DFN200X300X100-9N]  88.27,33.4 90 bottom
USB  5_USB_3S  [MICRO-AB-H-SMT]  100.97,44.45 90 top
VIO  MCP1727-ADJE/MF  [DFN65P300X300X100-9N]  6.98,28.57 90 top
VP+  TPTP16SQ  [TP16SQ]  31.75,43.18 180 bottom
VP-  TPTP16SQ  [TP16SQ]  31.75,45.4 180 bottom
WW  MCP1727-ADJE/MF  [DFN65P300X300X100-9N]  43.18,38.1 0 top
X1  PICO-SPOX-5  [PICO-SPOX-5]  101.28,28.57 270 top
ZED  µZ-FCI-CONONLY  [µZ-CONONLY]  50.8,28.57 180 bottom

## Tracks (layer width: path | path; a pad name or v marks a point on that pad's centre or on a via)
!RESET  (via drill 0.2)
  Top 0.152: v92.81,50.16 92.81,49.53 | C3.1 93.06,48.58 arc-90 92.81,48.83 U1.34 92.81,49.53 | R111.2 92.81,49.53 | R121.1 92.81,49.53
  Bottom 0.152: U1.34 v92.81,50.16
A_!RST  (via drill 0.2)
  Top 0.203: PB-NW.1 20.7,44.8 arc90 20.45,44.54 20.45,37.11 arc-45 20.33,36.84 v19.37,35.88 | v17.65,29.84 17.65,24.11 U8.19
  Route15 0.203: v19.37,35.88 18.6,35.11 arc45 18.41,34.66 18.41,30.87 arc-45 18.23,30.42 v17.65,29.84
A_SCL  (via drill 0.2)
  Top 0.203: PB-NW.2 23.56,44.8 arc90 23.18,44.41 v23.18,40.64 | v24.76,37.15 24.55,37.15 arc90 24.29,36.89 U4.5
  Bottom 0.203: R101.2 24.45,36.83 arc-90 v24.76,37.15 24.37,37.54 arc-45 24.26,37.81 24.26,39.47 arc-45 24.37,39.74 24.4,39.77 arc45 24.51,40.04 24.51,40.26 arc90 24.13,40.64 v23.18,40.64
A_SCL'  (via drill 0.2)
  Top 0.203: v24.45,31.75 23.93,32.26 arc-45 23.74,32.71 U4.3
  Bottom 0.203: R98.2 v24.45,31.75 arc45 24.29,31.38 24.29,29.2 arc45 24.41,28.93 25.16,28.18 arc45 25.43,28.07 43.15,28.07 arc45 43.42,28.18 47.77,32.53 arc-45 48.04,32.64 63.04,32.64 arc-45 63.39,32.49 64.8,31.08 arc45 65.25,30.89 U27.8
A_SDA  (via drill 0.2)
  Top 0.203: PB-NW.4 24.07,44.3 arc90 23.81,44.04 v23.81,40 | v23.74,37.15 U4.6
  Bottom 0.203: 23.49,36.13 R100.2 23.49,36.74 arc-45 23.61,37.01 v23.74,37.15 arc45 23.81,37.31 v23.81,40
A_SDA'  (via drill 0.2)
  Top 0.203: v23.49,31.75 23.43,31.81 arc-45 23.24,32.26 U4.2
  Bottom 0.203: U27.7 65.16,30.18 arc-45 64.8,30.32 63.14,31.98 arc45 62.78,32.13 48.29,32.13 arc45 48.02,32.02 43.67,27.67 arc-45 43.4,27.56 25.18,27.56 arc-45 24.91,27.67 23.86,28.72 arc-45 23.74,28.99 23.74,31.24 arc45 23.56,31.69 v23.49,31.75 R97.2
AB_SCL  (via drill 0.2)
  Top 0.203: U25.3 60.45,25.86 arc45 60.63,25.41 v60.96,25.08
  Bottom 0.203: ZED.113 65.6,11.71 arc45 65.49,11.98 63.1,14.37 arc-45 62.99,14.64 62.99,22.47 arc45 62.81,22.92 61.15,24.58 arc-45 60.96,25.03 v60.96,25.08 60.96,26.61 arc90 60.58,26.99 R93.2
AB_SCL'  (via drill 0.2)
  Top 0.203: U25.5 v61,30.73
  Route15 0.203: v75.56,31.75 73.77,29.96 arc-45 73.5,29.84 62.04,29.84 arc-45 61.77,29.96 v61,30.73
  Bottom 0.203: R96.2 60.62,29.53 arc90 61,29.91 v61,30.73 | v75.56,31.75 75.31,31.75 arc90 75.06,31.5 75.06,31.15 arc-90 74.8,30.89 U27.1
AB_SDA  (via drill 0.2, 0.33)
  Top 0.203: U25.2 59.95,25.54 arc45 v60.13,25.09 v60.14,25.08
  Route15 0.203: v65.6,2.54 65.6,10.12 arc45 65.49,10.39 v62.48,13.4
  Bottom 0.203: ZED.114 v65.6,2.54 | v62.48,13.4 62.48,22.28 arc45 62.3,22.73 60.28,24.75 arc-45 v60.14,25.08 R92.2
AB_SDA'  (via drill 0.2)
  Top 0.203: U25.6 60.45,29.12 arc45 60.56,28.85 v60.83,28.57
  Route15 0.203: v75.56,30.8 74.22,29.45 arc-45 73.95,29.34 61.75,29.34 arc45 61.48,29.22 v60.83,28.57
  Bottom 0.203: R95.2 v60.83,28.57 | v75.56,30.8 75.56,30.42 arc-90 75.31,30.17 U27.2
B_!RST
  Top 0.203: PB-SE.1 81.03,12.36 arc90 81.28,12.61 81.28,20.69 arc-45 81.47,21.14 83,22.67 arc45 83.19,23.12 83.19,29.25 arc-45 83.33,29.61 83.52,29.79 arc45 83.66,30.15 83.66,32.25 arc-45 83.74,32.43 83.79,32.48 arc45 83.86,32.66 U9.19
B_SCL  (via drill 0.2)
  Top 0.203: PB-SE.2 78.04,12.36 arc90 78.42,12.74 v78.42,16.51 | v76.83,20 77.05,20 arc90 77.3,20.26 U5.5
  Bottom 0.203: R106.2 77.15,20.32 arc-90 v76.83,20 77.23,19.61 arc-45 77.34,19.34 77.34,17.68 arc-45 77.23,17.41 77.2,17.38 arc45 77.09,17.11 77.09,16.89 arc90 77.47,16.51 v78.42,16.51
B_SCL'  (via drill 0.2)
  Top 0.203: v77.15,25.4 77.67,24.89 arc-45 77.85,24.44 U5.3
  Bottom 0.203: U27.5 71.38,28.79 arc-45 71.65,28.68 72.28,28.05 arc45 72.55,27.94 75.41,27.94 arc-45 75.68,27.83 76.97,26.54 arc-45 77.15,26.09 v77.15,25.4 R103.2
B_SDA  (via drill 0.2)
  Top 0.203: PB-SE.4 77.53,12.85 arc90 77.79,13.11 v77.79,17.46 | v77.85,20 U5.6
  Bottom 0.203: R105.2 78.1,20.41 arc-45 77.99,20.14 v77.85,20 arc45 77.79,19.84 v77.79,17.46
B_SDA'  (via drill 0.2)
  Top 0.203: v78.1,25.4 78.17,25.34 arc-45 78.35,24.89 U5.2
  Bottom 0.203: U27.4 75.19,28.79 arc-45 75.46,28.68 77.92,26.22 arc-45 78.1,25.77 v78.1,25.4 R102.2
BANK13_00_N  (via drill 0.2)
  Top 0.152: BETA.89 v35.2,51.44
  Bottom 0.152: ZED.89 v35.2,51.44
BANK13_00_P  (via drill 0.2)
  Top 0.152: BETA.87 v36,51.44
  Bottom 0.152: ZED.87 v36,51.44
BANK13_01_N  (via drill 0.2)
  Top 0.152: BETA.90 v35.2,50.16
  Bottom 0.152: ZED.90 v35.2,50.16
BANK13_01_P  (via drill 0.2)
  Top 0.152: BETA.88 v36,50.16
  Bottom 0.152: ZED.88 v36,50.16
BANK13_02_N  (via drill 0.2)
  Top 0.152: BETA.93 v33.6,51.44
  Bottom 0.152: ZED.93 v33.6,51.44
BANK13_02_P  (via drill 0.2)
  Top 0.152: BETA.91 v34.4,51.44
  Bottom 0.152: ZED.91 v34.4,51.44
BANK13_03_N  (via drill 0.2)
  Top 0.152: BETA.94 v33.6,50.16
  Bottom 0.152: ZED.94 v33.6,50.16
BANK13_03_P  (via drill 0.2)
  Top 0.152: BETA.92 v34.4,50.16
  Bottom 0.152: ZED.92 v34.4,50.16
BANK13_04_N  (via drill 0.2)
  Top 0.152: BETA.195 v32.8,6.98
  Bottom 0.152: ZED.195 v32.8,6.98
BANK13_04_P  (via drill 0.2)
  Top 0.152: BETA.193 v33.6,6.98
  Bottom 0.152: ZED.193 v33.6,6.98
BANK13_05_N  (via drill 0.2)
  Top 0.152: BETA.196 v32.8,5.71
  Bottom 0.152: ZED.196 v32.8,5.71
BANK13_05_P  (via drill 0.2)
  Top 0.152: BETA.194 v33.6,5.71
  Bottom 0.152: ZED.194 v33.6,5.71
BANK13_06_N  (via drill 0.2)
  Top 0.152: BETA.199 v31.2,6.98
  Bottom 0.152: ZED.199 v31.2,6.98
BANK13_06_P  (via drill 0.2)
  Top 0.152: BETA.197 v32,6.98
  Bottom 0.152: ZED.197 v32,6.98
BANK13_SE_0  (via drill 0.2)
  Top 0.203: BETA.200 v31.2,5.71
  Bottom 0.203: ZED.200 v31.2,5.71
BETA_5V  (via drill 0.2)
  Top 0.152: 91.67,27.07 91.27,26.67 v90.81,26.67
  Top 0.813: X1.4A X1.4 91.67,27.07 R70.1
  Bottom 0.152: U22.3 91.06,28.57 arc-90 91.44,28.19 91.44,27.46 arc-45 91.33,27.19 v90.81,26.67
BETA_5V'  (via drill 0.2, 0.3, 0.33, 0.36, 0.41)
  Top 0.152: R70.2 v89.53,26.67
  Top 0.305: WW.2 41.15,38.43 arc-90 40.89,38.68 40.89,38.75 40.89,38.81 arc-90 41.15,39.06 WW.1 | EE.2 60.45,18.72 arc-90 60.71,18.47 60.71,18.4 60.71,18.34 arc-90 60.45,18.09 EE.1 | NW.2 50.67,38.43 arc-90 50.42,38.68 50.42,38.75 50.42,38.81 arc-90 50.67,39.06 NW.1 | SE.2 50.93,18.72 arc-90 51.18,18.47 51.18,18.4 51.18,18.34 arc-90 50.93,18.09 SE.1 | NN.2 60.2,38.43 arc-90 59.94,38.68 59.94,38.75 59.94,38.81 arc-90 60.2,39.06 NN.1 | SS.2 41.4,18.72 arc-90 41.66,18.47 41.66,18.4 41.66,18.34 arc-90 41.4,18.09 SS.1 | NE.2 69.72,38.43 arc-90 69.47,38.68 69.47,38.75 69.47,38.81 arc-90 69.72,39.06 NE.1 | SW.2 31.88,18.72 arc-90 32.13,18.47 32.13,18.4 32.13,18.34 arc-90 31.88,18.09 SW.1 | VIO.1 6.02,26.54 arc90 6.27,26.29 6.34,26.29 6.4,26.29 arc90 6.65,26.54 VIO.2 | MXN.1 6.02,41.78 arc90 6.27,41.53 6.34,41.53 6.4,41.53 arc90 6.65,41.78 MXN.2 | RFE.2 68.28,26.16 arc-90 68.53,26.42 68.59,26.42 68.66,26.42 arc-90 68.91,26.16 RFE.1 | IOE.1 68.91,18.54 arc90 68.66,18.8 68.59,18.8 68.53,18.8 arc90 68.28,18.54 IOE.2 | IOW.1 32.69,38.61 arc90 32.94,38.35 33.01,38.35 33.07,38.35 arc90 33.32,38.61 IOW.2 | RFW.2 33.32,30.99 arc-90 33.07,30.73 33.01,30.73 32.94,30.73 arc-90 32.69,30.99 RFW.1 | MCN.1 6.02,34.16 arc90 6.27,33.91 6.34,33.91 6.4,33.91 arc90 6.65,34.16 MCN.2 | MCS.1 6.02,18.92 arc90 6.27,18.67 6.34,18.67 6.4,18.67 arc90 6.65,18.92 MCS.2 | MXS.1 6.02,11.3 arc90 6.27,11.05 6.34,11.05 6.4,11.05 arc90 6.65,11.3 MXS.2
  Top 0.406: U12.5 v84.2,39.37 84.2,38.82 arc90 84.45,38.57 C33.1 | U13.5 v84.2,43.81 84.2,43.27 arc90 84.45,43.02 C36.1 | U10.5 v17.4,17.78 17.4,18.33 arc90 17.14,18.58 C27.1 | U11.5 v17.4,13.33 17.4,13.88 arc90 17.14,14.13 C30.1
  Top 0.457: C72.1 v36.19,31.11 v36.19,30.48
  Top 0.508: C75.1 v36.19,38.73 v36.19,38.1 arc-90 35.56,37.47 33.64,37.47 arc-90 33.01,38.1 33.01,38.35 | v36.19,30.48 arc-90 35.56,29.84 33.64,29.84 arc-90 33.01,30.48 33.01,30.73
  Top 0.559: C15.1 v41.27,35.56 v40.64,35.56 arc-90 40,36.2 40,38.11 arc-90 40.64,38.75 40.89,38.75 | C39.1 v60.32,21.59 v60.96,21.59 arc-90 61.59,20.95 61.59,19.04 arc-90 60.96,18.4 60.71,18.4 | C18.1 v50.8,35.56 v50.16,35.56 arc-90 49.53,36.2 49.53,38.11 arc-90 50.16,38.75 50.42,38.75 | C42.1 v50.8,21.59 v51.43,21.59 arc-90 52.07,20.95 52.07,19.04 arc-90 51.43,18.4 51.18,18.4 | C21.1 v60.32,35.56 v59.69,35.56 arc-90 59.05,36.2 59.05,38.11 arc-90 59.69,38.75 59.94,38.75 | C45.1 v41.27,21.59 v41.91,21.59 arc-90 42.54,20.95 42.54,19.04 arc-90 41.91,18.4 41.66,18.4 | C24.1 v69.85,35.56 v69.22,35.56 arc-90 68.58,36.2 68.58,38.11 arc-90 69.22,38.75 69.47,38.75 | C48.1 v31.75,21.59 v32.38,21.59 arc-90 33.02,20.95 33.02,19.04 arc-90 32.38,18.4 32.13,18.4 | C57.1 v9.52,26.67 v9.52,26.04 arc-90 8.89,25.4 6.97,25.4 arc-90 6.34,26.04 6.34,26.29 | C63.1 v9.52,41.91 v9.52,41.27 arc-90 8.89,40.64 6.97,40.64 arc-90 6.34,41.27 6.34,41.53 | C66.1 v65.41,26.04 v65.41,26.67 arc-90 66.04,27.3 67.96,27.3 arc-90 68.59,26.67 68.59,26.42 | C69.1 v65.41,18.41 v65.41,19.05 arc-90 66.04,19.68 67.96,19.68 arc-90 68.59,19.05 68.59,18.8 | C60.1 v9.52,34.29 v9.52,33.66 arc-90 8.89,33.02 6.97,33.02 arc-90 6.34,33.66 6.34,33.91 | C54.1 v9.52,19.05 v9.52,18.41 arc-90 8.89,17.78 6.97,17.78 arc-90 6.34,18.41 6.34,18.67 | C51.1 v9.52,11.43 v9.52,10.79 arc-90 8.89,10.16 6.97,10.16 arc-90 6.34,10.79 6.34,11.05
  Top 1.016: R70.2 v88.67,23.49
  Bottom 0.152: 18.4,38.1 C78.1 | U22.4 90.42,28.07 arc-90 90.81,27.69 90.81,27.46 arc-45 90.69,27.19 90.28,26.78 arc-45 90.01,26.67 v89.53,26.67
  Bottom 0.203: C78.1 18.41,38.07 | 83.2,19.05 C81.1 83.19,19.05
  Bottom 0.406: CNW.1 18.4,38.1 | 18.41,38.07 v18.41,36.51 | CSE.1 83.2,19.05 | v83.19,20.95 83.19,19.05
  Bottom 0.813: v88.67,25.4 v88.67,24.45 v88.67,23.49 94.23,23.49 | 94.23,23.49 U26.3 | 94.23,23.49 94.23,22.17 C83.1
  pour Route2: 8.25,43.81 11.43,43.81 11.43,37.47 19.05,37.47 19.05,34.29 11.43,34.29 11.43,20.95 30.48,20.95 30.48,22.86 63.5,22.86 63.5,27.3 69.85,27.3 69.85,22.23 80.01,22.23 80.01,34.29 38.1,34.29 38.1,29.84 31.75,29.84 31.75,40 78.1,40 78.1,45.09 85.09,45.09 85.09,26.04 89.85,26.04 89.85,17.14 22.22,17.14 22.22,12.06 11.43,12.06 11.43,8.89 8.25,8.89
BETA_TDI  (via drill 0.2)
  Top 0.203: BETA.4 v69.6,47.12 | R118.2 v92.96,53.34
  Route2 0.203: v69.6,47.12 69.6,48.99 arc45 69.49,49.26 68.69,50.05 arc-45 68.58,50.32 68.58,54.96 arc-45 68.69,55.23 69.36,55.89 arc-45 69.63,56.01 91.41,56.01 arc-45 91.68,55.89 92.85,54.72 arc-45 92.96,54.45 v92.96,53.34
BETA_TDO  (via drill 0.2)
  Top 0.203: BETA.3 v69.6,54.61 | v90.49,51.62 R116.1
  Route2 0.203: v90.49,51.62 90.23,51.62 arc-90 89.85,52 89.85,54.07 arc45 89.74,54.34 89.07,55.01 arc45 88.81,55.12 70.27,55.12 arc45 70,55.01 v69.6,54.61
CD  (via drill 0.2)
  Top 0.203: SD1.CD1 v90.04,9.62 | SD1.CD2 v90.04,15.62
  Bottom 0.203: U28.1 v90.04,9.62 v90.04,15.62
CD'  (via drill 0.2)
  Top 0.203: U9.20 84.58,33.54 arc-90 84.84,33.29 84.84,32.98 arc-45 84.69,32.62 84.31,32.24 arc45 84.16,31.88 84.16,29.89 arc-45 84.02,29.53 83.84,29.36 arc45 83.69,29 83.69,22.23 arc90 84.33,21.59 86.73,21.59 arc-45 87.18,21.4 v88.27,20.32
  Bottom 0.203: U28.16 90.04,5.21 arc-90 89.79,4.95 arc-45 89.78,4.95 R109.2 88.52,4.95 arc-90 88.27,5.2 v88.27,20.32
CLK  (via drill 0.2)
  Top 0.203: SD1.5 v93.98,12.22
  Bottom 0.203: v93.98,12.22 93.1,12.22 arc45 92.83,12.11 92.16,11.44 arc45 92.05,11.17 U28.6
CMD  (via drill 0.2)
  Top 0.203: SD1.3 v93.98,14.42
  Bottom 0.203: U28.5 91.64,13.12 arc-45 91.75,13.39 92.67,14.31 arc-45 92.94,14.42 v93.98,14.42 R122.2
CNW_EN  (via drill 0.2)
  Top 0.203: U8.22 17.02,22.61 arc-90 16.51,23.12 v16.51,28.89
  Bottom 0.203: CNW.3 16.52,30.23 arc45 16.51,30.2 v16.51,28.89
CNW_PG  (via drill 0.2)  (1 unrouted)
  Top 0.203: U8.21 17.27,23.11 arc-90 17.02,23.36 v17.02,29.21
  Route15 0.203: v16.51,40.64 16.51,29.98 arc45 16.7,29.53 v17.02,29.21
  Bottom 0.152: CNW.4 16.52,43.18 C76.1
  Bottom 0.203: CNW.4 v16.51,40.64
CSE_EN  (via drill 0.2)
  Top 0.203: v85.08,22.54 84.82,22.8 arc-45 84.71,23.07 84.71,28.49 arc-45 84.86,28.85 85.02,29.01 arc45 85.16,29.37 85.16,31.36 arc-45 85.31,31.72 85.71,32.12 arc45 85.86,32.48 85.86,33.91 arc90 85.22,34.54 U9.22
  Bottom 0.203: CSE.3 v85.08,22.54
CSE_PG  (via drill 0.2)
  Top 0.203: U9.21 84.96,34.04 arc-90 85.34,33.66 85.34,32.72 arc-45 85.19,32.36 84.81,31.98 arc45 84.66,31.62 84.66,29.63 arc-45 84.52,29.27 84.35,29.11 arc45 84.2,28.75 84.2,22.64 arc45 84.31,22.37 v84.45,22.23
  Route15 0.203: v85.08,16.51 84.45,17.13 v84.45,22.23
  Bottom 0.152: CSE.4 85.08,13.97 C79.1
  Bottom 0.203: v85.08,16.51 CSE.4
CSO_N_V'  (via drill 0.2, 0.41)
  Top 0.152: R67.1 9.29,55.88 v10.16,55.88
  Top 0.813: L12.2 v0.66,35.2 | v0.66,49.53 6.98,49.53 arc90 7.62,50.16 7.62,54.61 arc-90 8.25,55.25 R67.1
  Bottom 0.152: v10.16,55.88 10.16,55.63 arc90 10.41,55.37 11.99,55.37 arc-90 12.24,55.12 U14.1
  Bottom 0.813: v0.66,35.2 v0.66,49.53
CSO_NE_V  (via drill 0.2)
  Top 0.152: v11.43,55.88 12.29,55.88 R67.2
  Top 0.457: 67.49,56.49 67.62,56.52 arc-90 68,56.13 BETA.7
  Top 0.813: R67.2 13.97,55.25 arc90 14.6,55.88 arc-90 15.21,56.49 67.49,56.49
  Bottom 0.152: U14.2 12.64,54.47 arc90 12.89,54.73 12.89,55.63 arc90 12.64,55.88 v11.43,55.88
CSO_NW_V  (via drill 0.36, 0.41)
  Top 0.61: v18.41,44.77 18.41,45.72 arc-90 18.73,46.04 v20.95,46.04
  Bottom 0.305: CNW.5 18.41,41.81
  Bottom 0.508: 18.41,41.81 18.41,43.18 C77.1
  Bottom 0.559: v18.41,44.77 18.41,43.18 | v20.95,46.04 PWR-NW.6
CSO_S_V'  (via drill 0.2)
  Top 0.152: R71.1 9.29,1.27 v10.16,1.27
  Top 0.813: L10.2 1.29,19.95 arc90 0.66,19.32 0.66,8.25 arc90 1.29,7.62 6.98,7.62 arc-90 7.62,6.98 7.62,2.54 arc90 8.25,1.9 R71.1
  Bottom 0.152: U15.1 8.95,2.18 arc90 8.7,1.92 8.7,1.52 arc90 8.95,1.27 v10.16,1.27
CSO_SE_V  (via drill 0.36, 0.41)
  Top 0.61: v83.19,12.38 83.19,11.43 arc-90 82.87,11.11 v80.64,11.11
  Bottom 0.508: CSE.5 83.19,15.34 83.19,13.97 C80.1
  Bottom 0.559: v83.19,12.38 83.19,13.97 | v80.64,11.11 PWR-SE.6
CSO_SW_V  (via drill 0.2)
  Top 0.152: R71.2 12.29,1.27 v11.43,1.27
  Top 0.457: 65.89,0.66 66.02,0.63 arc90 66.4,1.02 BETA.112
  Top 0.813: R71.2 13.97,1.9 arc-90 14.6,1.27 arc90 15.21,0.66 65.89,0.66
  Bottom 0.152: U15.2 8.76,2.68 arc90 8.38,2.29 8.38,1.14 arc90 8.76,0.76 11.18,0.76 arc90 11.43,1.02 v11.43,1.27
DAT0  (via drill 0.2)
  Top 0.203: SD1.7 v93.98,10.02
  Bottom 0.203: U28.7 92.43,9.23 arc-45 92.54,9.5 92.95,9.91 arc-45 93.22,10.02 v93.98,10.02 R123.2
DAT1  (via drill 0.2)
  Top 0.203: SD1.8 v93.98,8.92
  Bottom 0.203: U28.8 92.84,8.38 arc-45 92.95,8.65 93.11,8.81 arc-45 93.38,8.92 v93.98,8.92 R124.2
DAT2  (via drill 0.2)
  Top 0.203: SD1.1 v93.98,16.62
  Bottom 0.203: U28.3 90.83,14.81 arc-45 90.94,15.08 92.37,16.51 arc-45 92.64,16.62 v93.98,16.62 R125.2
DAT3  (via drill 0.2)
  Top 0.203: SD1.2 v93.98,15.52
  Bottom 0.203: v93.98,15.52 92.79,15.52 arc45 92.52,15.41 91.35,14.23 arc45 91.24,13.96 U28.4
E_I2C_EN
  Top 0.152: U9.5 81.16,38.17 arc90 80.91,38.42 U12.3
E_I2C_V  (via drill 0.36)
  Top 0.356: U12.1 80.64,40.35 v80.64,41.59
  Bottom 0.356: PWR-NE.6 81.25,53.97 arc-90 81.64,53.59 81.64,42.85 arc-45 81.45,42.4 v80.64,41.59 C31.1
E_SPI_EN
  Top 0.152: U9.2 82.66,38.17 arc-90 82.92,38.42 U12.4
E_SPI_V  (via drill 0.36)
  Top 0.356: U12.6 83.19,40.35 v83.19,41.59
  Bottom 0.356: PWR-NE.8 82.57,53.97 arc90 82.19,53.59 82.19,42.85 arc45 82.38,42.4 v83.19,41.59 C32.1
E_VE  (via drill 0.2, 0.36)
  Top 0.152: R57.2 v60.32,13.97
  Top 0.813: R57.2 60.32,12.51 arc90 60.71,12.13 74.04,12.13 v74.3,12.38
  Bottom 0.152: U19.2 55.11,12.45 arc90 55.49,12.06 59.94,12.06 arc90 60.32,12.45 v60.32,13.97
  Bottom 0.813: PWR-SE.4 78.1,11.75 arc90 77.47,12.38 v74.3,12.38
E_VE'  (via drill 0.2)
  Top 0.152: R57.1 v60.32,15.24
  Top 0.508: L5.2 58.6,16.1 R57.1
  Bottom 0.152: U19.1 55.61,12.76 arc90 55.99,12.38 59.31,12.38 arc90 59.69,12.76 59.69,14.86 arc-90 60.07,15.24 v60.32,15.24
EE_CLK1
  Bottom 0.152: R112.1 100.08,43.23 U2.4 100.13,44.2 arc90 99.87,44.45 96.65,44.45 96.53,44.34 U1.44
EE_CS1
  Bottom 0.152: U1.45 96.56,43.84 arc45 96.74,43.91 96.83,43.99 arc-45 97.01,44.07 98.93,44.07 arc-90 99.19,43.81 U2.5 R113.1
EE_DATA1
  Bottom 0.152: R115.2 99.76,47.03 arc45 99.84,46.85 100.05,46.63 arc-45 100.13,46.45 U2.3 100.13,45.09 arc-90 99.87,44.83 96.27,44.83 96.26,44.84 U1.43
EE_EN  (via drill 0.2, 0.33)
  Top 0.203: EE.3 60.71,19.38 arc90 60.96,19.63 v60.96,20.32 | U6.7 52.75,24.88 arc45 52.86,24.61 53.35,24.11 arc45 53.62,24 60.17,24 arc-45 60.44,23.89 60.85,23.48 arc-45 60.96,23.21 v60.96,22.86
  Bottom 0.203: v60.96,20.32 61.21,20.32 arc90 61.59,20.7 61.59,22.48 arc90 61.21,22.86 v60.96,22.86
EE_PG
  Top 0.203: EE.5 56.45,20.02 arc-90 56.2,20.27 56.2,23.11 arc90 55.82,23.49 53.34,23.49 arc-45 53.08,23.61 52.16,24.52 arc-45 52.05,24.79 U6.6
FTDI_D_N  (via drill 0.2)
  Top 0.152: USB.2 v92.71,43.8 92.67,43.84 arc45 92.4,43.95 U3.1
  Bottom 0.152: U1.6 91.31,43.04 arc-90 92.07,43.8 v92.71,43.8
FTDI_D_P  (via drill 0.2)
  Top 0.152: USB.3 v92.71,44.45 U3.2
  Bottom 0.152: U1.7 90.81,43.18 arc-90 92.08,44.45 v92.71,44.45
FTDI_TCK  (via drill 0.2)
  Top 0.203: BETA.1 v70.4,51.44
  Route2 0.203: v70.4,51.44 70.4,53.56 arc-45 70.51,53.83 70.8,54.12 arc-45 71.07,54.23 86.65,54.23 arc-45 86.92,54.12 87.2,53.83 arc-45 87.31,53.56 87.31,45.6 arc45 87.42,45.34 88.15,44.61 arc-45 88.27,44.34 v88.27,42.34
  Bottom 0.203: U1.13 v88.27,42.34 | v70.4,51.44 ZED.1
FTDI_TDI  (via drill 0.2)
  Top 0.203: v87.76,42.84 87.76,50.03 arc-45 87.87,50.3 88.25,50.69 arc-45 88.52,50.8 91.69,50.8 arc90 92.07,51.18 R117.1 R118.1
  Bottom 0.203: v87.76,42.84 U1.14
FTDI_TDO  (via drill 0.2)
  Route2 0.203: v69.6,51.44 69.6,53.63 arc-45 69.71,53.9 70.38,54.56 arc-45 70.65,54.67 86.96,54.67 arc-45 87.23,54.56 87.64,54.15 arc-45 87.76,53.88 87.76,45.91 arc45 87.87,45.64 88.66,44.84 arc-45 88.77,44.57 v88.77,43.34
  Bottom 0.203: U1.15 v88.77,43.34 | v69.6,51.44 ZED.3
FTDI_TMS  (via drill 0.2)
  Top 0.203: BETA.2 v70.4,47.12
  Route2 0.203: v70.4,47.12 70.4,49.92 arc-45 70.51,50.19 70.82,50.5 arc45 70.93,50.77 70.93,53.25 arc-45 71.04,53.52 71.2,53.67 arc-45 71.47,53.78 86.33,53.78 arc-45 86.6,53.67 86.76,53.52 arc-45 86.87,53.25 86.87,46.91 arc-45 86.76,46.64 v85.85,45.74
  Bottom 0.203: v70.4,47.12 ZED.2 | U1.16 86.11,43.84 arc-90 85.85,44.09 v85.85,45.74
GND  (via drill 0.2, 0.3, 0.33, 0.38, 0.41, 0.61, 3.17 pad 4.5)
  Top 0.127: v92.71,45.09 92.69,45.06
  Top 0.152: USB.5 96.84,46.04 v97.15,46.35 arc45 v97.16,46.36
  Top 0.203: 15.75,32.26 v15.88,32.38 15.88,32.26 U7.23 | 50.04,27.81 v50.16,27.94 50.16,27.81 U6.23 47.62,27.82 | U7.25 v17.14,33.66 | U6.25 v51.43,29.21 | 82.68,35.05 v82.55,34.92 | 82.55,35.05 v82.55,34.92 | U9.25 v81.28,33.66 | U9.23 82.66,35.04 v82.55,34.92 | 18.92,22.1 v19.05,22.23 | 19.05,22.1 v19.05,22.23 | U8.25 v20.32,23.49 | U8.23 18.93,22.11 v19.05,22.23 | 92.69,45.06 arc-45 92.42,44.95 U3.3
  Bottom 0.152: U2.2 99.19,46.36 arc90 98.93,46.61 97.57,46.61 arc45 97.3,46.5 v97.16,46.36
  Bottom 0.203: U27.6 70.63,29.52 arc45 70.9,29.63 71.33,30.05 arc45 71.44,30.32 v71.44,30.8 | U15.5 10.79,4.18 U15.EPAD | U14.5 10.79,52.97 U14.EPAD | U18.5 47.99,42.55 U18.EPAD | U20.5 67.04,42.55 v66.67,42.55 U20.EPAD | U17.5 34.56,14.6 U17.EPAD | U19.5 53.61,14.6 U19.EPAD | U21.5 71.75,19.64 | U22.5 88.27,27.57 U22.EPAD